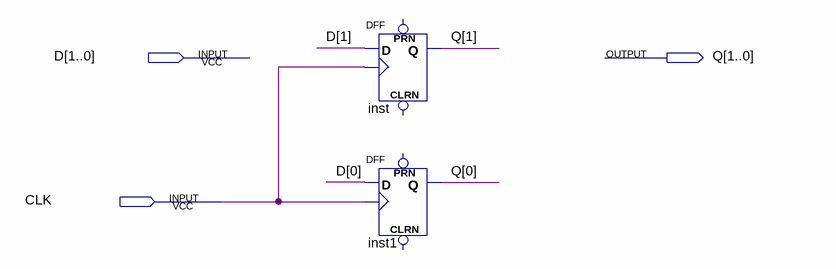
[diagram p0: schematic sheet]
// Quartus schematic CURRENT_STAGE.bdf as structural Verilog: 2 symbols, 3 pins
module CURRENT_STAGE (
  input  [1:0] D,
  input  CLK,
  output [1:0] Q
);

  DFF inst (.CLK(CLK), .D(D[1]), .Q(Q[1]));  // open: CLRN, PRN
  DFF inst1 (.CLK(CLK), .D(D[0]), .Q(Q[0]));  // open: CLRN, PRN
endmodule
